# Altium schematic sheet USB_Arduino.SchDoc
size B
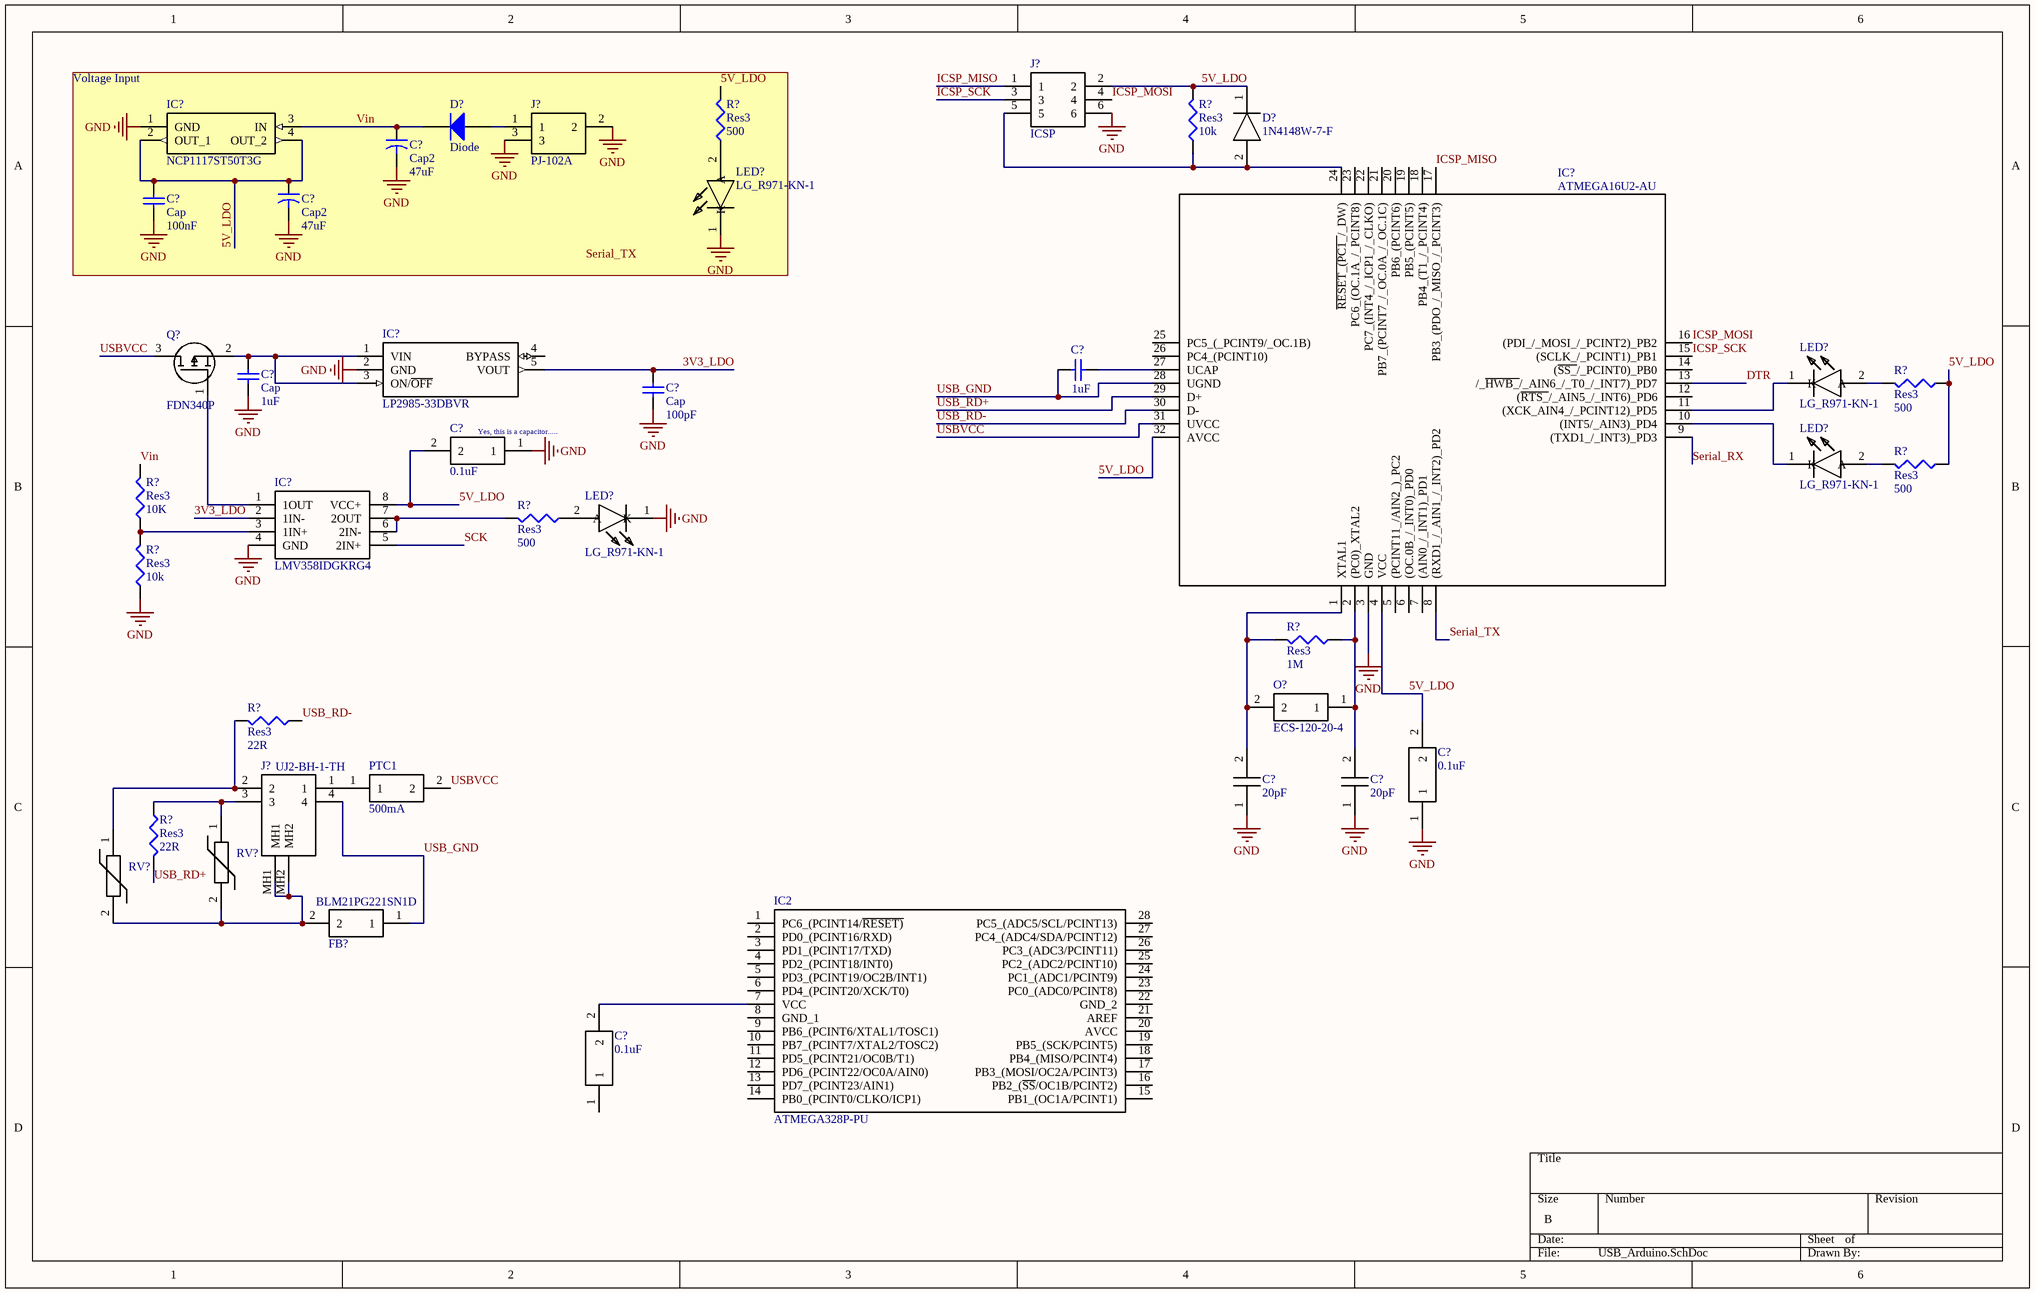
[diagram p0: USB_Arduino.SchDoc]

## Parts
(Parts that share a designator on the sheet are numbered #1, #2 ... from top to bottom, then left to right.)
C?#1  Cap2  value 47uF  [CAPR5-4X5]
C?#2  Cap2  value 47uF  [CAPR5-4X5]
C?#3  Cap  value 100nF  [RAD-0.3]
C?#4  Cap  value 1uF  [RAD-0.3]
C?#5  value 1uF  [RAD-0.3]  (hidden comment: Cap)
C?#6  Cap  value 100pF  [RAD-0.3]
C?#7  0.1uF  [CAPC2012X95N]
C?#8  20pF  [CAPC1005X60N]
C?#9  20pF  [CAPC1005X60N]
C?#10  0.1uF  [CAPC2012X95N]
C?#11  0.1uF  [CAPC2012X95N]
D?#1  1N4148W-7-F  [SOD3716X115N]
D?#2  Diode  [SMC]
FB?  BLM21PG221SN1D  [BEADC2012X105N]
IC2  ATMEGA328P-PU  [DIP794W53P254L3467H457Q28N]
IC?#1  NCP1117ST50T3G  [SOT230P700X180-4N]
IC?#2  LP2985-33DBVR  [SOT95P280X145-5N]
IC?#3  LMV358IDGKRG4  [SOP65P490X110-8N]
IC?#4  ATMEGA16U2-AU  [QFP80P900X900X120-32N]
J?#1  ICSP  [HDRV6W64P254_2X3_762X508X868P]
J?#2  PJ-102A  [PJ-102AH]
J?#3  UJ2-BH-1-TH  [UJ2BH1TH]
LED?#1  LG_R971-KN-1  [LEDC2012X80N]
LED?#2  LG_R971-KN-1  [LEDC2012X80N]
LED?#3  LG_R971-KN-1  [LEDC2012X80N]
LED?#4  LG_R971-KN-1  [LEDC2012X80N]
O?  ECS-120-20-4  [HC-49USX]
PTC1  500mA  [FUSC4632X85N]
Q?  FDN340P  [SOT95P237X112-3N]
R?#1  Res3  value 500  [J1-0603]
R?#2  Res3  value 10k  [J1-0603]
R?#3  Res3  value 500  [J1-0603]
R?#4  Res3  value 500  [J1-0603]
R?#5  Res3  value 10K  [J1-0603]
R?#6  Res3  value 500  [J1-0603]
R?#7  Res3  value 10k  [J1-0603]
R?#8  Res3  value 1M  [J1-0603]
R?#9  Res3  value 22R  [J1-0603]
R?#10  Res3  value 22R  [J1-0603]
RV?#1  CG0603MLC-05E  [VARC1608X55N]  (value not drawn)
RV?#2  CG0603MLC-05E  [VARC1608X55N]  (value not drawn)

## Blocks framed on the sheet
Voltage Input: C?#1-C?#3 D?#2 IC?#1 J?#2 LED?#1 R?#1

## Nets
GND: C?#1.2 C?#2.2 C?#3.1 C?#4.1 C?#6.1 C?#7.1 C?#8.1(C1) C?#9.1(C1) C?#10.1 IC?#1.1(GND) IC?#2.2(GND) IC?#3.4(GND) IC?#4.3(GND) J?#1.6 J?#2.2 J?#2.3 LED?#1.1(K) LED?#4.1(K) R?#7.1
3V3_LDO: C?#6.2 IC?#2.5(VOUT) IC?#3.2(1IN-)
5V_LDO: C?#2.1 C?#3.2 C?#7.2 C?#10.2 D?#1.1(K) IC?#1.2(OUT_1) IC?#1.4(OUT_2) IC?#3.8(VCC+) IC?#4.4(VCC) IC?#4.32(AVCC) J?#1.2 R?#1.2 R?#2.2 R?#3.1 R?#4.1
DTR: IC?#4.13(/_~{HWB_}/_AIN6_/_T0_/_INT7)_PD7)
ICSP_MISO: IC?#4.17(PB3_(PDO_/_MISO_/_PCINT3)) J?#1.1
ICSP_MOSI: IC?#4.16((PDI_/_MOSI_/_PCINT2)_PB2) J?#1.4
ICSP_SCK: IC?#4.15((SCLK_/_PCINT1)_PB1) J?#1.3
SCK: IC?#3.5(2IN+)
Serial_RX: IC?#4.9((TXD1_/_INT3)_PD3)
Serial_TX: IC?#4.8((RXD1_/_AIN1_/_INT2)_PD2)
USB_GND: C?#5.2 FB?.1 IC?#4.28(UGND) J?#3.4
USB_RD+: IC?#4.29(D+) R?#10.2
USB_RD-: IC?#4.30(D-) R?#9.1
USBVCC: IC?#4.31(UVCC) PTC1.2 Q?.3(D)
Vin: C?#1.1 D?#2.2(K) IC?#1.3(IN) R?#5.2
NetC?#4_2: C?#4.2 IC?#2.1(VIN) IC?#2.3(ON/~{OFF}) Q?.2(S)
NetC?#5_1: C?#5.1 IC?#4.27(UCAP)
NetC?#8_2: C?#8.2(C2) IC?#4.1(XTAL1) O?.2 R?#8.2
NetC?#9_2: C?#9.2(C2) IC?#4.2((PC0)_XTAL2) O?.1 R?#8.1
NetC?#11_2: C?#11.2 IC2.7(VCC)
NetD?#1_2: D?#1.2(A) IC?#4.24(~{RESET_(PC1_}/_DW)) J?#1.5 R?#2.1
NetD?#2_1: D?#2.1(A) J?#2.1
NetFB?_2: FB?.2 J?#3.MH1 J?#3.MH2 RV?#1.2 RV?#2.2
NetIC?#3_1: IC?#3.1(1OUT) Q?.1(G)
NetIC?#3_3: IC?#3.3(1IN+) R?#5.1 R?#7.2
NetIC?#3_6: IC?#3.6(2IN-) IC?#3.7(2OUT) R?#6.2
NetIC?#4_10: IC?#4.10((INT5/_AIN3)_PD4) LED?#3.1(K)
NetIC?#4_11: IC?#4.11((XCK_AIN4_/_PCINT12)_PD5) LED?#2.1(K)
NetJ?#3_1: J?#3.1 PTC1.1
NetJ?#3_2: J?#3.2 R?#9.2 RV?#2.1
NetJ?#3_3: J?#3.3 R?#10.1 RV?#1.1
NetLED?#1_2: LED?#1.2(A) R?#1.1
NetLED?#2_2: LED?#2.2(A) R?#3.2
NetLED?#3_2: LED?#3.2(A) R?#4.2
NetLED?#4_2: LED?#4.2(A) R?#6.1

Not connected (* = marked no-connect by the designer): C?#11 1; IC2 1(PC6_(PCINT14/~{RESET)}) 2(PD0_(PCINT16/RXD)) 3(PD1_(PCINT17/TXD)) 4(PD2_(PCINT18/INT0)) 5(PD3_(PCINT19/OC2B/INT1)) 6(PD4_(PCINT20/XCK/T0)) 8(GND_1) 9(PB6_(PCINT6/XTAL1/TOSC1)) 10(PB7_(PCINT7/XTAL2/TOSC2)) 11(PD5_(PCINT21/OC0B/T1)) 12(PD6_(PCINT22/OC0A/AIN0)) 13(PD7_(PCINT23/AIN1)) 14(PB0_(PCINT0/CLKO/ICP1)) 15(PB1_(OC1A/PCINT1)) 16(PB2_(~{SS}/OC1B/PCINT2)) 17(PB3_(MOSI/OC2A/PCINT3)) 18(PB4_(MISO/PCINT4)) 19(PB5_(SCK/PCINT5)) 20(AVCC) 21(AREF) 22(GND_2) 23(PC0_(ADC0/PCINT8)) 24(PC1_(ADC1/PCINT9)) 25(PC2_(ADC2/PCINT10)) 26(PC3_(ADC3/PCINT11)) 27(PC4_(ADC4/SDA/PCINT12)) 28(PC5_(ADC5/SCL/PCINT13)); IC?#2 4(BYPASS); IC?#4 5((PCINT11_/AIN2_)_PC2) 6((OC.0B_/_INT0)_PD0) 7((AIN0_/_INT1)_PD1) 12((~{RTS_}/_AIN5_/_INT6)_PD6) 14((~{SS_}/_PCINT0)_PB0) 18(PB4_(T1_/_PCINT4)) 19(PB5_(PCINT5)) 20(PB6_(PCINT6)) 21(PB7_(PCINT7_/_OC.0A_/_OC.1C)) 22(PC7_(INT4_/_ICP1_/_CLKO)) 23(PC6_(OC.1A_/_PCINT8)) 25(PC5_(_PCINT9/_OC.1B)) 26(PC4_(PCINT10))

## Notes on the sheet
- (near C?#7) Yes, this is a capacitor.....
- Labels drawn without touching a wire or pin: Serial_TX

## Library data of the parts
C?#1 C?#2 = Cap2: Capacitor; Published: 23-Sep-2002; PackageReference: CAPR5-4X5; Publisher: Altium Limited; PackageDescription: Capacitor; 2 Leads
C?#3-C?#6 = Cap: Capacitor; Published: 8-Jun-2000; LatestRevisionDate: 17-Jul-2002; LatestRevisionNote: Re-released for DXP Platform.; PackageReference: RAD-0.3; Publisher: Altium Limited; PackageDescription: Radial Cap, Thru-Hole; 2 Leads; 0.3 in Pin Spacing
C?#7 C?#10 C?#11 = CL21F104ZBCNNNC: Integrated Circuit; Manufacturer_Name: Samsung Electro-Mechanics; Datasheet Link: https://www.arrow.com/en/products/cl21f104zbcnnnc/samsung-electro-mechanics; Height: 0.95mm; Manufacturer_Part_Number: CL21F104ZBCNNNC
C?#8 C?#9 = C0402C200J5GACTU: Capacitor; Manufacturer_Name: Kemet; Manufacturer_Part_Number: C0402C200J5GACTU; Mouser Part Number: 80-C0402C200J5G; Mouser Price/Stock: https://www.mouser.com/Search/Refine.aspx?Keyword=80-C0402C200J5G; RS Part Number: 8015167P; RS Price/Stock: http://uk.rs-online.com/web/p/products/8015167P
D?#1 = 1N4148W-7-F: Diode; Manufacturer_Name: Diodes Inc.; Allied_Number: 71028125; Datasheet Link: https://componentsearchengine.com/Datasheets/2/1N4148W-7-F.pdf; Height: 1.15mm; Manufacturer_Part_Number: 1N4148W-7-F; Mouser Part Number: 621-1N4148W-F; Mouser Price/Stock: https://www.mouser.com/Search/Refine.aspx?Keyword=621-1N4148W-F; RS Part Number: 7384728P; RS Price/Stock: http://uk.rs-online.com/web/p/products/7384728P; Allied Price/Stock: https://www.alliedelec.com/diodes-inc-1n4148w-7-f/71028125/
D?#2 = Diode: Default Diode; Published: 8-Jun-2000; LatestRevisionDate: 17-Jul-2002; LatestRevisionNote: Re-released for DXP Platform.; PackageVersion: Sep-1996; PackageReference: SMC; Publisher: Altium Limited; PackageDescription: DO-214-AB/SMC; 2 C-Bend Leads; Body 7.9 x 5.9 mm, inc. leads (LxW); Code_JEDEC: DO-214-AB
FB? = BLM21PG221SN1D: Ferrite Bead; Manufacturer_Name: Murata Electronics; Datasheet Link: http://docs-asia.electrocomponents.com/webdocs/1388/0900766b813885e8.pdf; Height: 1.05mm; Manufacturer_Part_Number: BLM21PG221SN1D; Mouser Part Number: 81-BLM21P221SG; Mouser Price/Stock: https://www.mouser.com/Search/Refine.aspx?Keyword=81-BLM21P221SG; RS Part Number: 7241532P; RS Price/Stock: http://uk.rs-online.com/web/p/products/7241532P
IC2 = ATMEGA328P-PU: Integrated Circuit; Manufacturer_Name: Microchip; Datasheet Link: http://ww1.microchip.com/downloads/en/DeviceDoc/Atmel-42735-8-bit-AVR-Microcontroller-ATmega328-328P_Datasheet.pdf; Height: 4.572mm; Manufacturer_Part_Number: ATMEGA328P-PU; Mouser Part Number: 556-ATMEGA328P-PU; Mouser Price/Stock: https://www.mouser.com/Search/Refine.aspx?Keyword=556-ATMEGA328P-PU; RS Part Number: 9222142P; RS Price/Stock: http://uk.rs-online.com/web/p/products/9222142P
IC?#1 = NCP1117ST50T3G: Integrated Circuit; Manufacturer_Name: ON Semiconductor; Allied_Number: 70466898; Datasheet Link: http://www.onsemi.com/pub/Collateral/NCP1117-D.PDF; Height: 1.8mm; Manufacturer_Part_Number: NCP1117ST50T3G; Mouser Part Number: 863-NCP1117ST50T3G; Mouser Price/Stock: https://www.mouser.com/Search/Refine.aspx?Keyword=863-NCP1117ST50T3G; RS Part Number: 8022130P; RS Price/Stock: http://uk.rs-online.com/web/p/products/8022130P; Allied Price/Stock: http://www.alliedelec.com/on-semiconductor-ncp1117st50t3g/70466898/
IC?#2 = LP2985-33DBVR: Integrated Circuit; Manufacturer_Name: Texas Instruments; Datasheet Link: http://www.ti.com/lit/gpn/lp2985; Height: 1.45mm; Manufacturer_Part_Number: LP2985-33DBVR; Mouser Part Number: 595-LP2985-33DBVR; Mouser Price/Stock: https://www.mouser.com/Search/Refine.aspx?Keyword=595-LP2985-33DBVR
IC?#3 = LMV358IDGKRG4: Integrated Circuit; Manufacturer_Name: Texas Instruments; Datasheet Link: http://www.ti.com/lit/ds/symlink/lmv358.pdf; Height: 1.1mm; Manufacturer_Part_Number: LMV358IDGKRG4; Mouser Part Number: 595-LMV358IDGKRG4; Mouser Price/Stock: https://www.mouser.com/Search/Refine.aspx?Keyword=595-LMV358IDGKRG4
IC?#4 = ATMEGA16U2-AU: Integrated Circuit; Manufacturer_Name: Microchip; Datasheet Link: http://www.atmel.com/images/doc7799.pdf; Height: 1.2mm; Manufacturer_Part_Number: ATMEGA16U2-AU; Mouser Part Number: 556-ATMEGA16U2-AU; Mouser Price/Stock: https://www.mouser.com/Search/Refine.aspx?Keyword=556-ATMEGA16U2-AU; RS Part Number: 1278282P; RS Price/Stock: http://uk.rs-online.com/web/p/products/1278282P
J?#1 = M20-9980346: Connector; Manufacturer_Name: HARWIN; Datasheet Link: https://cdn.harwin.com/pdfs/M20-998.pdf?utm_source=3D_PDF&utm_medium=3D_PDF&utm_campaign=3D_PDF; Height: 8.68mm; Manufacturer_Part_Number: M20-9980346; Mouser Part Number: 855-M20-9980346; Mouser Price/Stock: https://www.mouser.com/Search/Refine.aspx?Keyword=855-M20-9980346; RS Part Number: 7457046P; RS Price/Stock: http://uk.rs-online.com/web/p/products/7457046P
J?#2 = PJ-102A: Connector; Manufacturer_Name: CUI; Datasheet Link: https://www.cui.com/product/resource/pj-102a.pdf; Manufacturer_Part_Number: PJ-102A; Mouser Part Number: 490-PJ-102A; Mouser Price/Stock: https://www.mouser.com/Search/Refine.aspx?Keyword=490-PJ-102A
J?#3 = UJ2-BH-1-TH: Connector; Manufacturer_Name: CUI; Datasheet Link: http://www.cui.com/product/resource/uj2-bh-th.pdf; Height: 10mm; Manufacturer_Part_Number: UJ2-BH-1-TH; Mouser Part Number: 490-UJ2-BH-1-TH; Mouser Price/Stock: https://www.mouser.com/Search/Refine.aspx?Keyword=490-UJ2-BH-1-TH
LED?#1-LED?#4 = LG_R971-KN-1: LED; Manufacturer_Name: OSRAM Opto Semiconductors; Manufacturer_Part_Number: LG R971-KN-1; Datasheet Link: http://www.mouser.com/ds/2/311/LG R971 - CHIPLED 0805-318376.pdf; Height: 0.8mm; Mouser Part Number: 720-LGR971-KN-1; Mouser Price/Stock: https://www.mouser.com/Search/Refine.aspx?Keyword=720-LGR971-KN-1
O? = ECS-120-20-4: Crystal or Oscillator; Manufacturer_Name: ECS; Datasheet Link: https://ecsxtal.com/store/pdf/hc_49us.pdf; Manufacturer_Part_Number: ECS-120-20-4; Mouser Part Number: 520-HCU1200-20; Mouser Price/Stock: https://www.mouser.com/Search/Refine.aspx?Keyword=520-HCU1200-20
PTC1 = MF-MSMF050-2: Fuse; Manufacturer_Name: Bourns; Allied_Number: 70153466; Datasheet Link: https://www.bourns.com/pdfs/mfmsmf.pdf; Height: 0.85mm; Manufacturer_Part_Number: MF-MSMF050-2; Mouser Part Number: 652-MF-MSMF050-2; Mouser Price/Stock: https://www.mouser.com/Search/Refine.aspx?Keyword=652-MF-MSMF050-2; RS Part Number: 6478156P; RS Price/Stock: http://uk.rs-online.com/web/p/products/6478156P; Allied Price/Stock: https://www.alliedelec.com/bourns-mf-msmf050-2/70153466/
Q? = FDN340P: MOSFET (P-Channel); Manufacturer_Name: ON Semiconductor; Datasheet Link: https://www.onsemi.com/pub/Collateral/FDN340P-D.PDF; Height: 1.12mm; Manufacturer_Part_Number: FDN340P; Mouser Part Number: 512-FDN340P; Mouser Price/Stock: https://www.mouser.com/Search/Refine.aspx?Keyword=512-FDN340P; RS Part Number: 6710435P; RS Price/Stock: http://uk.rs-online.com/web/p/products/6710435P
R?#1-R?#10 = Res3: Resistor; Published: 8-Jun-2000; LatestRevisionDate: 29-May-2009; LatestRevisionNote: IPC-7351 Footprint Added.; PackageReference: J1-0603; Publisher: Altium Limited; PackageDescription: Chip Resistor
RV?#1 RV?#2 = CG0603MLC-05E: Varistor; Manufacturer_Name: Bourns; Allied_Number: 70153503; Datasheet Link: http://www.farnell.com/datasheets/1785244.pdf; Height: 0.55mm; Manufacturer_Part_Number: CG0603MLC-05E; Mouser Part Number: 652-CG0603MLC-05E; Mouser Price/Stock: https://www.mouser.com/Search/Refine.aspx?Keyword=652-CG0603MLC-05E; RS Part Number: 8518256; RS Price/Stock: http://uk.rs-online.com/web/p/products/8518256; Allied Price/Stock: https://www.alliedelec.com/bourns-cg0603mlc-05e/70153503/